# Altium schematic sheet STEP_DOWN.SchDoc: =DocumentName
size A4; ENG_APP_DATE: --/--/--; DSN_APP_DATE: --/--/--; CHK_APP_DATE: --/--/--; CompanyName: "AS Manufacturing" LLC; Organization: "AS Manufacturing" LLC; Address1: 5 Sklyarenka St.; Address2: Kyiv 04073; Address3: Ukraine; Address4: https://ajax.systems/en/; SheetNumber: 2; SheetTotal: 4; Template_version: 1.0.1
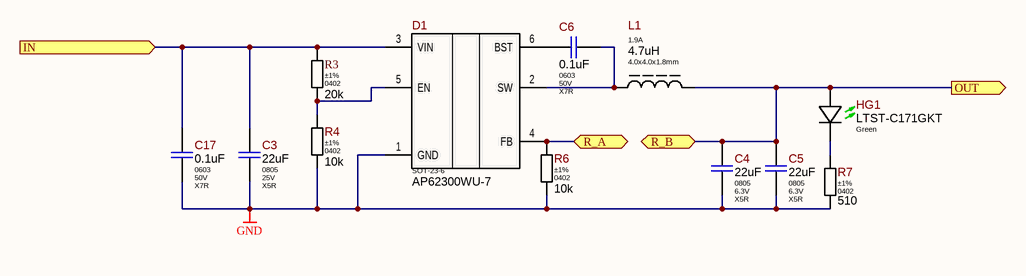
[diagram p0: STEP_DOWN.SchDoc]

## Parts
C3  Package: 0805  Voltage: 25V  Dielectric Type: X5R  [CAP-0805(2012)X125T20]  (hidden comment: 22uF)
C4  Package: 0805  Voltage: 6.3V  Dielectric Type: X5R  [C_CERAMIC_0805_MED]  (hidden comment: 22uF)
C5  Package: 0805  Voltage: 6.3V  Dielectric Type: X5R  [C_CERAMIC_0805_MED]  (hidden comment: 22uF)
C6  Package: 0603  Voltage: 50V  Dielectric Type: X7R  [C_CERAMIC_0603_MED]  (hidden comment: 0.1uF)
C17  Package: 0603  Voltage: 50V  Dielectric Type: X7R  [C_CERAMIC_0603_MED]  (hidden comment: 0.1uF)
D1  AP62300WU-7  [SOT-23-6]
HG1  Color: Green  [LTST-C171GKT]  (hidden comment: LTST-C171GKT)
L1  Current: 1.9A  Package: 4.0x4.0x1.8mm  [SRN4018-Series_1.8mm]  (hidden comment: 4.7uH)
R3  Tolerance: ±1%  Package: 0402  [R_ANY_CHIP_0402_MED]  (hidden comment: 20k)
R4  Tolerance: ±1%  Package: 0402  [R_ANY_CHIP_0402_MED]  (hidden comment: 10k)
R6  Tolerance: ±1%  Package: 0402  [R_ANY_CHIP_0402_MED]  (hidden comment: 10k)
R7  Tolerance: ±1%  Package: 0402  [R_ANY_CHIP_0402_MED]  (hidden comment: 510)

## Ports
IN (in), OUT (out), R_A (bidir), R_B (bidir)

## Nets
GND: C3.2 C4.2 C5.2 C17.1 D1.1(GND) R4.2 R6.2 R7.1
IN: C3.1 C17.2 D1.3(VIN) R3.1 ; port IN
OUT: C4.1 C5.1 HG1.AN(Anode) L1.2 ; port OUT, port R_B
R_A: D1.4(FB) R6.1 ; port R_A
NetC6_1: C6.1 D1.2(SW) L1.1
NetC6_2: C6.2 D1.6(BST)
NetD1_5: D1.5(EN) R3.2 R4.1
NetHG1_CA: HG1.CA(Cathode) R7.2

## Notes on the sheet
- Title
- Product:
- Project:
- Size:
- Date:
- Variant:
- A4
- Authors:
- Time:
- Sheet
- of
- Revision:
- Commit:

## Library data of the parts
C3 = CL21A226MAYNNNE: 22uF 25V X5R ±20% 0805 Ceramic Capacitor RoHS; Manufacturer: Samsung Electro-Mechanics; Ajax_1C_ID: 35089; Ajax_1C_PN: 22uF 25V X5R 20% 0805 CL21A226MAYNNNE Ceramic Capacitor SMD RoHS; Ajax_1С_Status: Mass Production; Standard Lead Time: 24 Weeks; Component Status: Released; Replacement: NONE; Value: 22uF; Part Number: CL21A226MAYNNNE; Part Type: Ceramic / X5R / 0805; Component Type: SMD; Temperature Range: -55°C ~ 85°C; Tolerance: ±20%; ComponentLink1URL: https://eu.mouser.com/datasheet/2/585/MLCC-1837944.pdf; Supplier 1: Mouser; Supplier Part Number 1: 187-CL21A226MAYNNNE; ComponentLink1Description: Datasheet
C4 C5 = GRM21BR60J226ME39L: 22uF 6.3V X5R ±20% 0805 Ceramic Capacitor RoHS; Manufacturer: Murata Electronics; Ajax_1C_ID: 10647; Ajax_1C_PN: 22uF 6.3V X5R 20% 0805 GRM21BR60J226ME39L / CL21A226MQQNNNG Ceramic Capacitor SMD RoHS; Ajax_1С_Status: Mass Production; Standard Lead Time: 15 Weeks; Component Status: Released; Replacement: NONE; Value: 22uF; Part Number: GRM21BR60J226ME39L; Part Type: Ceramic / X5R / 0805; Component Type: SMD; Temperature Range: -55°C ~ 85°C; Tolerance: ±20%; ComponentLink1URL: https://search.murata.co.jp/Ceramy/image/img/A01X/G101/ENG/GRM21BR60J226ME39-01.pdf; Supplier 1: Digi-Key; Supplier Part Number 1: 490-1719-2-ND; ComponentLink1Description: Datasheet
C6 C17 = CL10B104KB8NNND: 100nF 50V X7R ±10% 0603 Ceramic Capacitor RoHS; Manufacturer: Samsung Electro-Mechanics; Ajax_1C_ID: 21313; Ajax_1C_PN: 100nF 50V X7R 10% 0603 CL10B104KB8NNND ceramic capacitor SMD; Ajax_1С_Status: Substitution; Standard Lead Time: 18 Weeks; Component Status: Released; Replacement: CL10B104KB8NNNC; GUID_1C: f1fd6399-ca68-11ea-ab63-0050569f2651; Value: 0.1uF; Part Number: CL10B104KB8NNND; Part Type: Ceramic / X7R / 0603; Component Type: SMD; Temperature Range: -55°C ~ 125°C; Tolerance: ±10%; ComponentLink1URL: https://media.digikey.com/pdf/Data%20Sheets/Samsung%20PDFs/CL_Series_MLCC_ds.pdf; Supplier 1: Digi-Key; Supplier Part Number 1: CL10B104KB8NNND-ND; Price: 0,0039378; ComponentLink1Description: Datasheet
D1 = AP62300WU-7: 4.35V to 18V, 2A, High Efficiency Synchronous Step Down Converter, 500kHz, SOT-23-6; Manufacturer: Diodes Incorporated; Ajax_1С_Status: RND Only; Component Status: Released; Replacement: NONE; Part Type: Power / DC-DC / Buck; Component Type: SMD; Temperature Range: -40°C ~ 85°C; ComponentLink1Description: Datasheet; Package: SOT-23-6; Part Number: AP62300WU-7
HG1 = LTST-C171GKT: Low Power LED, Green 565nm, Clear, SMD 0805, Vf 2.1V - 2.6V, 5 ~ 12mcd @ 20 mA, 130°; Manufacturer: Lite-On Optoelectronics; Ajax_1C_PN: LTST-C171GKT Green SMD LED 0805 12mcd 20mA 130deg RoHS; Replacement: NONE; Ajax_1C_ID: 30364; Ajax_1С_Status: RND Only; Component Status: Released; GUID_1C: df39881f-c399-11eb-ab74-0050569f2651; Part Number: LTST-C171GKT; Part Type: LED / 0805; Component Type: SMD; Package: 0805; Wavelength: 565nm; Temperature Range: -55°C ~ 85°C; ComponentLink1URL: https://media.digikey.com/pdf/Data%20Sheets/Lite-On%20PDFs/LTST-C171GKT.pdf; Supplier 1: Digi-Key; Supplier Part Number 1: 160-1423-2-ND; ComponentLink1Description: Datasheet; Price: 0,0319
L1 = SRN4018-4R7M: 4.7uH Semi-Shielded Wirewound Inductor 1.9A 84mOhm Max; Manufacturer: Bourns Inc; Ajax_1C_ID: 20972; Ajax_1C_PN: 4.7uH SRN4018-4R7M SMD Индуктивность; Ajax_1С_Status: RND Only; Saturation Current: 2A; Tolerance: ±20%; Component Status: Released; Standard Lead Time: 42 Weeks; Replacement: NONE; Value: 4.7uH; Part Number: SRN4018-4R7M; Part Type: Power / Wirewound / Ferrite Core; Component Type: SMD; Temperature Range: -25°C ~ 120°C; ComponentLink1URL: https://eu.mouser.com/datasheet/2/54/srn4018-1391320.pdf; Supplier 1: Mouser; Supplier Part Number 1: 652-SRN4018-4R7M; ComponentLink1Description: Datasheet
R3 = RC0402FR-0720KL: 20 kOhms ±1% 1/16W 0402 Thick Film Resistor; Manufacturer: Yageo; Ajax_1C_ID: 7763; Ajax_1C_PN: 20k 1% 0402 Resistors SMD RoHS; Ajax_1С_Status: Mass Production; Power Rating: 0.062W; Voltage: 50V; Component Status: Released; Temperature Stability: ±100ppm/°C; Replacement: NONE; GUID_1C: 6df97e9a-d55b-11e5-8149-d8cb8a9acc66; Value: 20k; Part Number: RC0402FR-0720KL; Component Type: SMD; Part Type: Thick Film; Temperature Range: -55°C ~ 155°C; ComponentLink1URL: https://www.yageo.com/upload/media/product/productsearch/datasheet/rchip/PYu-RC_Group_51_RoHS_L_10.pdf; Price: 0,00065; ComponentLink1Description: Datasheet
R4 R6 = RC0402FR-0710KL: 10 kOhms ±1% 1/16W 0402 Thick Film Resistor; Manufacturer: Yageo; Ajax_1C_ID: 6717; Ajax_1C_PN: 10k 1% 0402 Resistors SMD RoHS; Ajax_1С_Status: Mass Production; Power Rating: 0.062W; Voltage: 50V; Component Status: Released; Temperature Stability: ±100ppm/°C; Replacement: NONE; Value: 10k; Part Number: RC0402FR-0710KL; Component Type: SMD; Temperature Range: -55°C ~ 155°C; ComponentLink1URL: https://www.yageo.com/upload/media/product/productsearch/datasheet/rchip/PYu-RC_Group_51_RoHS_L_10.pdf; ComponentLink1Description: Datasheet; Part Type: Thick Film; Supplier 1: Digi-Key; Supplier Part Number 1: 311-10.0KLRTR-ND
R7 = RC0402FR-07510RL: 510 Ohms ±1% 1/16W 0402 Thick Film Resistor; Manufacturer: Yageo; Ajax_1C_ID: 6480; Ajax_1C_PN: 510R 1% 0402 Resistors SMD RoHS; Power Rating: 0.062W; Voltage: 50V; Temperature Stability: ±100ppm/°C; Replacement: NONE; Ajax_1С_Status: Mass Production; Component Status: Released; GUID_1C: 3e23e3f0-fe1a-11e4-ad28-a45d36c4a9e5; Value: 510; Part Number: RC0402FR-07510RL; Component Type: SMD; Temperature Range: -55°C ~ 155°C; ComponentLink1URL: https://www.yageo.com/upload/media/product/productsearch/datasheet/rchip/PYu-RC_Group_51_RoHS_L_10.pdf; ComponentLink1Description: Datasheet; Supplier 1: Digi-Key; Supplier Part Number 1: 311-510LRTR-ND; Price: 0,00065; Part Type: Thick Film